# Altium project Node.PrjPcb
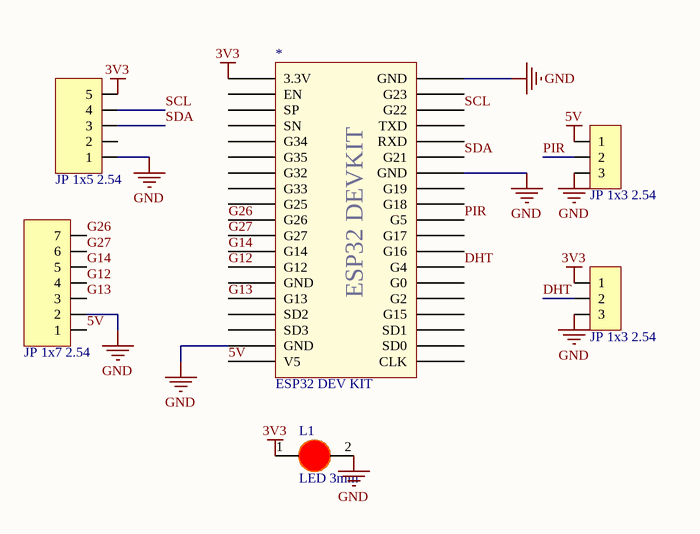
[diagram p0: node.SchDoc]
2 sheets, 9 parts. Net scope: global (net labels, ports and power ports of the same name join across sheets).
Board files: PCBNode.PcbDoc, PCBGateway.PcbDoc
Sheets:
  node.SchDoc
  GateWay.SchDoc

## Sheet node.SchDoc
size A

### Parts
*  ESP32 DEV KIT  [ESP32 DEVKIT]
JP1  JP 1x3 2.54  [JP 1x3 DT]
JP2  JP 1x5 2.54  [JP 1x5 CT]
JP3  JP 1x3 2.54  [JP 1x3 DT]
JP4  JP 1x7 2.54  [JP 1x7 CT]
L1  LED 3mm  [LED-3MM-RED]

### Nets
3V3: *.1(3.3V) JP2.5 JP3.1 L1.1(A)
5V: *.19(V5) JP1.1 JP4.1
GND: *.18(GND) *.32(GND) *.38(GND) JP1.3 JP2.1 JP3.3 JP4.2 L1.2(K)
DHT: *.26(G4) JP3.2
G12: *.13(G12) JP4.4
G13: *.15(G13) JP4.3
G14: *.12(G14) JP4.5
G26: *.10(G26) JP4.7
G27: *.11(G27) JP4.6
PIR: *.29(G5) JP1.2
SCL: *.36(G22) JP2.4
SDA: *.33(G21) JP2.3

Not connected (* = marked no-connect by the designer): * 2(EN) 3(SP) 4(SN) 5(G34) 6(G35) 7(G32) 8(G33) 9(G25) 14(GND) 16(SD2) 17(SD3) 20(CLK) 21(SD0) 22(SD1) 23(G15) 24(G2) 25(G0) 27(G16) 28(G17) 30(G18) 31(G19) 34(RXD) 35(TXD) 37(G23); JP2 2

### Notes on the sheet
- (in symbol ESP32 DEV KIT) ESP32 DEVKIT

### Library data of the parts
JP1 JP3 = JP 1x3 2.54 Duc Thang: Cắm; Ten_Linh_Kien: Jump Đơn Đực 2.54MM 1x40P Thẳng 11MM; Don_Vi: Con; Ma_Hang: MH000903; Ghi_Chu: *; Kieu_Chan: *; Chung_Loai: Cắm
JP2 = JP 1x5 2.54 Cai Thang: Cắm; Ten_Linh_Kien: Jump Đơn Cái 2.54MM 1x20P Thẳng; Don_Vi: Con; Ma_Hang: MH004006; Ghi_Chu: *; Kieu_Chan: *; Chung_Loai: Cắm
JP4 = JP 1x7 2.54 Cai Thang: Cắm; Ten_Linh_Kien: Jump Đơn Cái 2.54MM 1x20P Thẳng; Don_Vi: Con; Ma_Hang: MH004006; Ghi_Chu: *; Kieu_Chan: *; Chung_Loai: Cắm
L1 = LED 3mm Do: Cắm; Don_Vi: Con; Ma_Hang: MH003892; Ten_Linh_Kien: Led 3MM Phủ Đỏ (10c); Ghi_Chu: *; Kieu_Chan: *; Chung_Loai: Cắm

## Sheet GateWay.SchDoc
size A
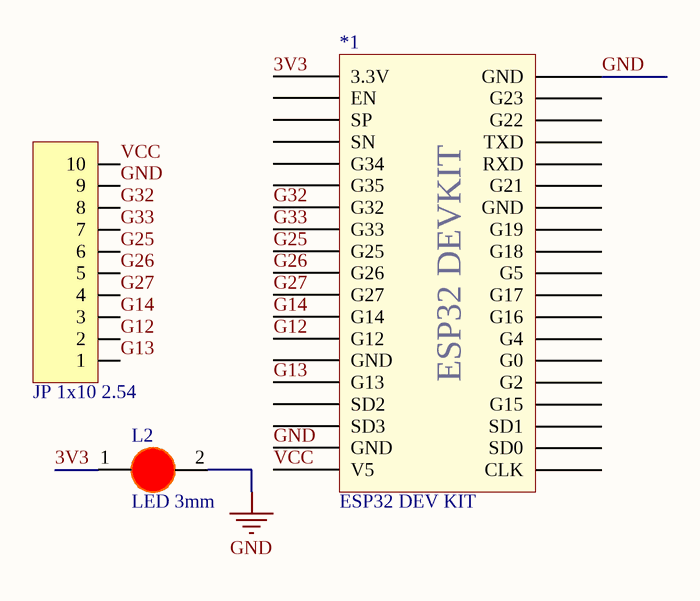
[diagram p1: GateWay.SchDoc]

### Parts
*1  ESP32 DEV KIT  [ESP32 DEVKIT]
JP5  JP 1x10 2.54  [JP 1x10 CT]
L2  LED 3mm  [LED-3MM-RED]

### Nets
3V3: *1.1(3.3V) L2.1(A)
GND: *1.18(GND) *1.38(GND) JP5.9 L2.2(K)
G12: *1.13(G12) JP5.2
G13: *1.15(G13) JP5.1
G14: *1.12(G14) JP5.3
G25: *1.9(G25) JP5.6
G26: *1.10(G26) JP5.5
G27: *1.11(G27) JP5.4
G32: *1.7(G32) JP5.8
G33: *1.8(G33) JP5.7
VCC: *1.19(V5) JP5.10

Not connected (* = marked no-connect by the designer): *1 2(EN) 3(SP) 4(SN) 5(G34) 6(G35) 14(GND) 16(SD2) 17(SD3) 20(CLK) 21(SD0) 22(SD1) 23(G15) 24(G2) 25(G0) 26(G4) 27(G16) 28(G17) 29(G5) 30(G18) 31(G19) 32(GND) 33(G21) 34(RXD) 35(TXD) 36(G22) 37(G23)

### Notes on the sheet
- (in symbol ESP32 DEV KIT) ESP32 DEVKIT

### Library data of the parts
JP5 = JP 1x10 2.54 Cai Thang: Cắm; Ten_Linh_Kien: Jump Đơn Cái 2.54MM 1x20P Thẳng; Don_Vi: Con; Ma_Hang: MH004006; Ghi_Chu: *; Kieu_Chan: *; Chung_Loai: Cắm
L2 = LED 3mm Do: as L1 on sheet node; Ghi_Chu: *; Kieu_Chan: *; Chung_Loai: Cắm

## Nets that join several sheets
3V3: node (*.1 JP2.5 JP3.1 L1.1), GateWay (*1.1 L2.1)
GND: node (8 pins), GateWay (*1.18 *1.38 JP5.9 L2.2)
G12: node (*.13 JP4.4), GateWay (*1.13 JP5.2)
G13: node (*.15 JP4.3), GateWay (*1.15 JP5.1)
G14: node (*.12 JP4.5), GateWay (*1.12 JP5.3)
G26: node (*.10 JP4.7), GateWay (*1.10 JP5.5)
G27: node (*.11 JP4.6), GateWay (*1.11 JP5.4)